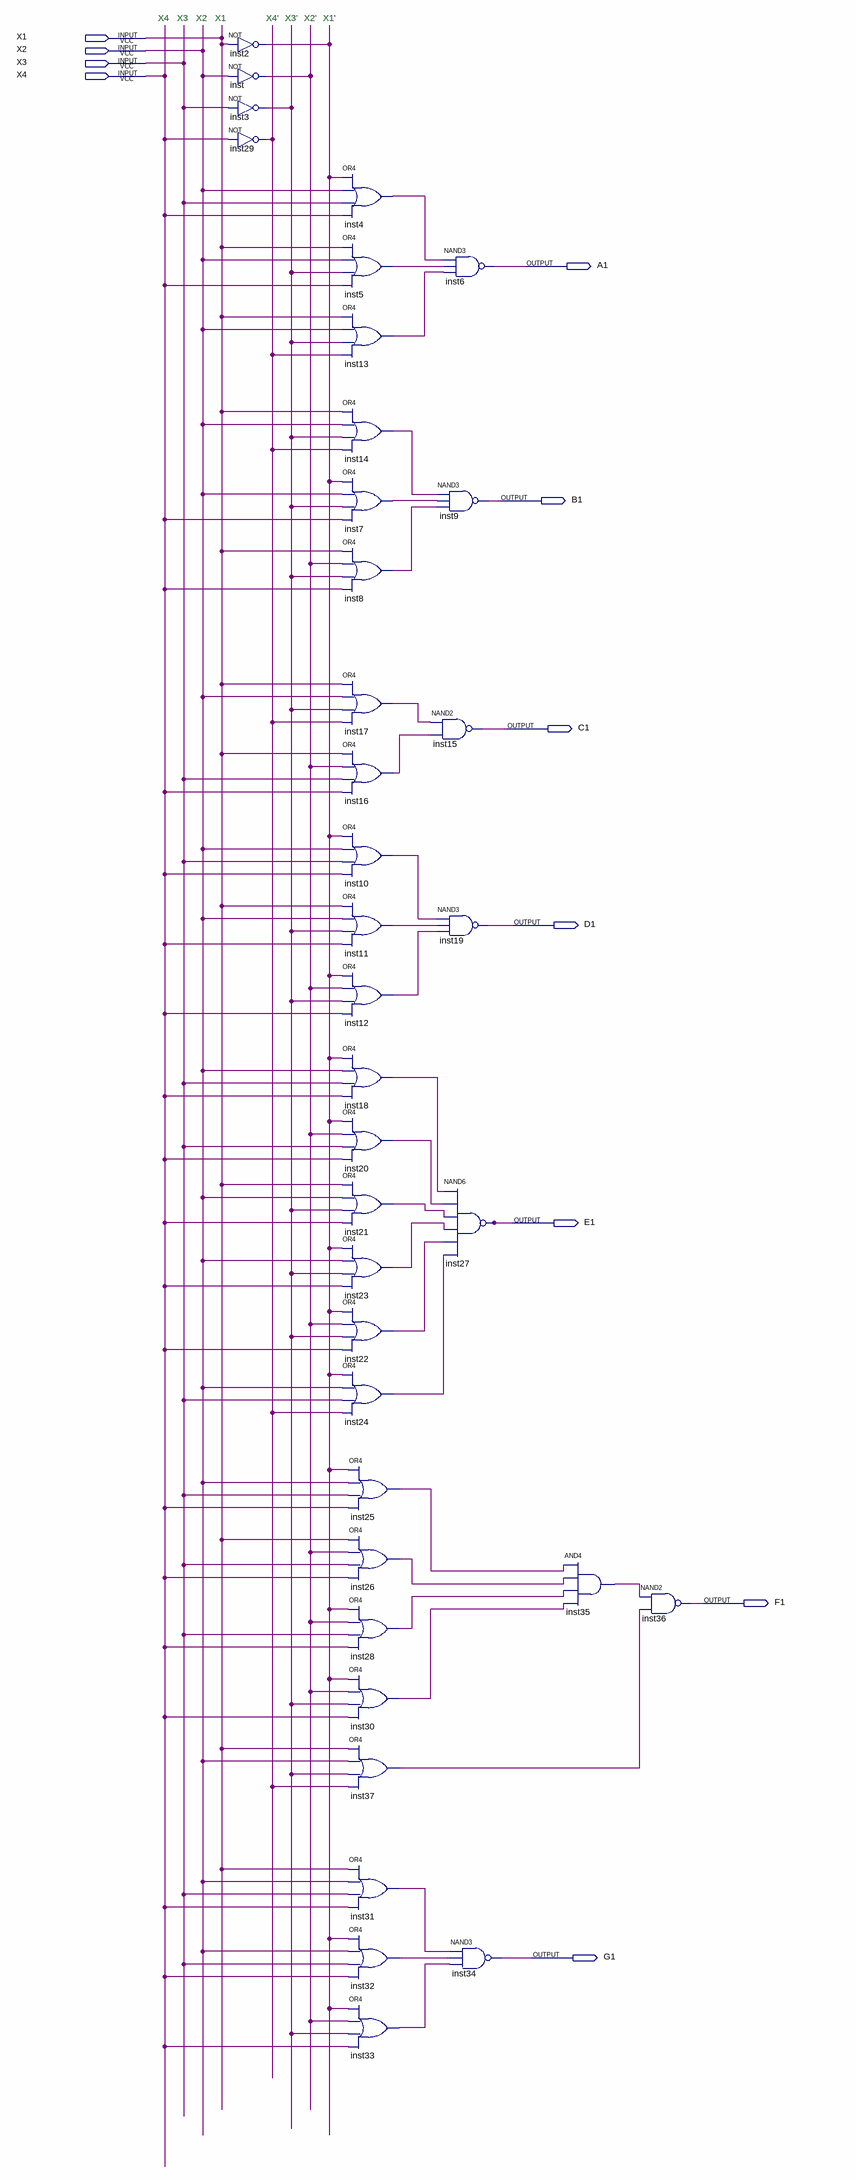
[diagram p0: schematic sheet]
// Quartus schematic Indicator1.bdf as structural Verilog: 37 symbols, 11 pins
module Indicator1 (
  input  X1,
  input  X2,
  input  X3,
  input  X4,
  output A1,
  output B1,
  output C1,
  output D1,
  output E1,
  output F1,
  output G1
);

  wire inst2_out, inst3_out, inst4_out, inst5_out, inst7_out, inst8_out, inst10_out, inst11_out, inst12_out,
       inst13_out, inst14_out, inst16_out, inst17_out, inst18_out, inst20_out, inst21_out, inst22_out,
       inst23_out, inst24_out, inst25_out, inst26_out, inst28_out, inst29_out, inst30_out, inst31_out,
       inst32_out, inst33_out, inst35_out, inst37_out, inst_out;

  not inst2 (inst2_out, X1);
  not inst (inst_out, X2);
  not inst3 (inst3_out, X3);
  not inst29 (inst29_out, X4);
  or inst4 (inst4_out, inst2_out, X2, X3, X4);
  or inst5 (inst5_out, X1, X2, inst3_out, X4);
  or inst13 (inst13_out, X1, X2, inst3_out, inst29_out);
  or inst14 (inst14_out, X1, X2, inst3_out, inst29_out);
  or inst7 (inst7_out, inst2_out, X2, inst3_out, X4);
  or inst8 (inst8_out, X1, inst_out, inst3_out, X4);
  or inst17 (inst17_out, X1, X2, inst3_out, inst29_out);
  or inst16 (inst16_out, X1, inst_out, X3, X4);
  or inst10 (inst10_out, inst2_out, X2, X3, X4);
  or inst11 (inst11_out, X1, X2, inst3_out, X4);
  or inst12 (inst12_out, inst2_out, inst_out, inst3_out, X4);
  or inst18 (inst18_out, inst2_out, X2, X3, X4);
  or inst20 (inst20_out, inst2_out, inst_out, X3, X4);
  or inst21 (inst21_out, X1, X2, inst3_out, X4);
  or inst23 (inst23_out, inst2_out, X2, inst3_out, X4);
  or inst22 (inst22_out, inst2_out, inst_out, inst3_out, X4);
  or inst24 (inst24_out, inst2_out, X2, X3, inst29_out);
  or inst25 (inst25_out, inst2_out, X2, X3, X4);
  or inst26 (inst26_out, X1, inst_out, X3, X4);
  or inst28 (inst28_out, inst2_out, inst_out, X3, X4);
  or inst30 (inst30_out, inst2_out, inst_out, inst3_out, X4);
  or inst37 (inst37_out, X1, X2, inst3_out, inst29_out);
  or inst31 (inst31_out, X1, X2, X3, X4);
  or inst32 (inst32_out, inst2_out, X2, X3, X4);
  or inst33 (inst33_out, inst2_out, inst_out, inst3_out, X4);
  nand inst6 (A1, inst4_out, inst5_out, inst13_out);
  nand inst9 (B1, inst14_out, inst7_out, inst8_out);
  nand inst15 (C1, inst17_out, inst16_out);
  nand inst19 (D1, inst10_out, inst11_out, inst12_out);
  nand inst27 (E1, inst18_out, inst20_out, inst21_out, inst23_out, inst22_out, inst24_out);
  nand inst34 (G1, inst31_out, inst32_out, inst33_out);
  and inst35 (inst35_out, inst25_out, inst26_out, inst28_out, inst30_out);
  nand inst36 (F1, inst35_out, inst37_out);

  // Notes on the sheet:
  //   X4
  //   X3
  //   X2
  //   X1
  //   X4'
  //   X3'
  //   X2'
  //   X1'
endmodule
